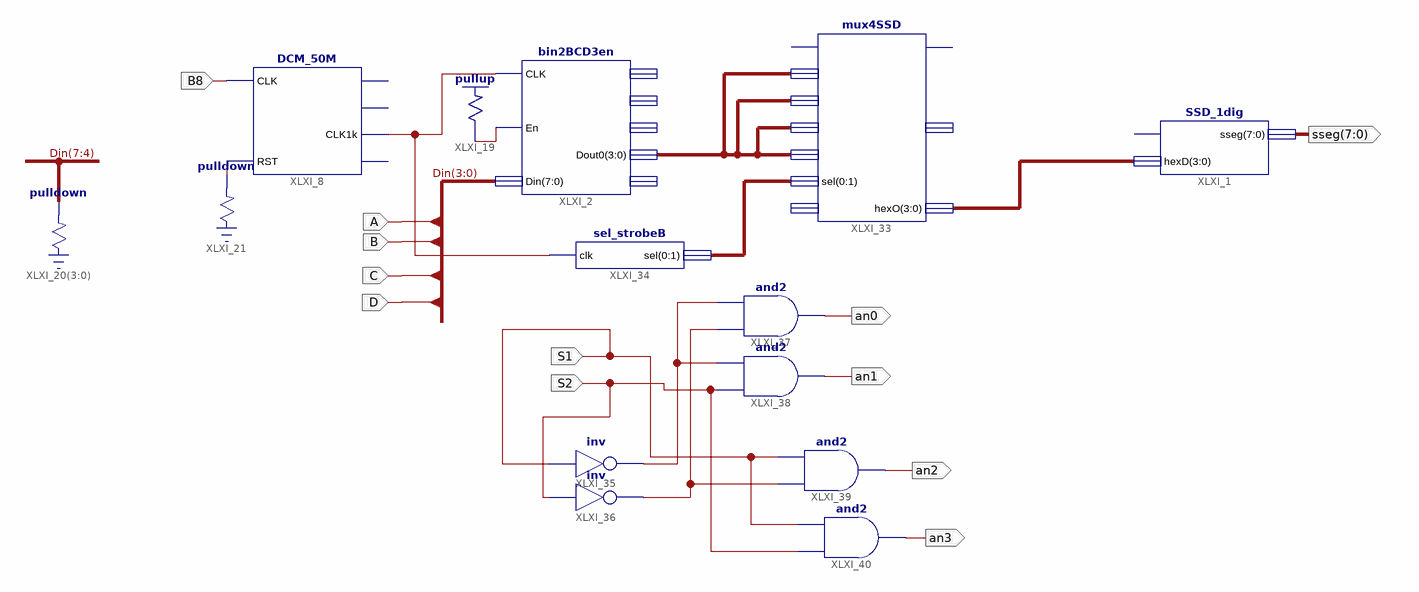
[diagram p0: schematic sheet 1]
// Xilinx ISE schematic exp6.sch (spartan3e) as structural Verilog: 14 symbols, 12 ports
module exp6 (
  input  B8,
  input  S1,
  input  S2,
  input  A,
  input  B,
  input  C,
  input  D,
  output [7:0] sseg,
  output an0,
  output an1,
  output an2,
  output an3
);

  wire XLXN_49, XLXN_54, XLXN_121, XLXN_133, XLXN_134;
  wire [1:0] XLXN_120;
  wire [3:0] XLXN_129, XLXN_141;
  wire [7:0] Din;

  SSD_1dig XLXI_1 (.hexD(XLXN_141), .sseg(sseg));  // open: dp_in
  DCM_50M XLXI_8 (.CLK(B8), .RST(XLXN_54), .CLK1k(XLXN_121));  // open: CLK1M, CLK10k, CLK1
  bin2BCD3en XLXI_2 (
    .CLK(XLXN_121), .En(XLXN_49), .Din(Din[3:0]), .Dout0(XLXN_129));  // open: Dout3, Dout2, Dout1, RBout
  \pullup  XLXI_19 (.O(XLXN_49));
  \pulldown  XLXI_20[3:0] (.O(Din[7:4]));
  \pulldown  XLXI_21 (.O(XLXN_54));
  mux4SSD XLXI_33 (
    .hexD(XLXN_129), .hexC(XLXN_129), .hexB(XLXN_129), .hexA(XLXN_129), .sel({XLXN_120[0], XLXN_120[1]}),
    .hexO(XLXN_141));  // open: rb_in, dp_in, dpO, anO
  sel_strobeB XLXI_34 (.clk(XLXN_121), .sel({XLXN_120[0], XLXN_120[1]}));
  and XLXI_37 (an0, XLXN_134, XLXN_133);
  and XLXI_38 (an1, S2, XLXN_133);
  and XLXI_39 (an2, XLXN_134, S1);
  and XLXI_40 (an3, S2, S1);
  not XLXI_35 (XLXN_133, S1);
  not XLXI_36 (XLXN_134, S2);
endmodule
